# Altium project PCB_Project.PrjPcb
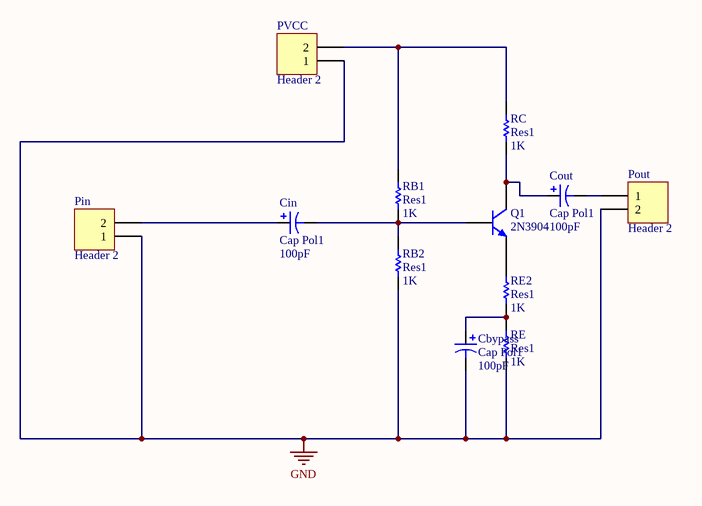
[diagram p0: Sheet1.SchDoc]
1 sheet, 12 parts. Net scope: global (net labels, ports and power ports of the same name join across sheets).
Board file: PCB1.PcbDoc

## Sheet Sheet1.SchDoc
size A

### Parts
Cbypass  Cap Pol1  value 100pF  [RB7.6-15]
Cin  Cap Pol1  value 100pF  [RB7.6-15]
Cout  Cap Pol1  value 100pF  [RB7.6-15]
Pin  Header 2  [HDR1X2]
Pout  Header 2  [HDR1X2]
PVCC  Header 2  [HDR1X2]
Q1  2N3904  [TO-92A]
RB1  Res1  value 1K  [AXIAL-0.3]
RB2  Res1  value 1K  [AXIAL-0.3]
RC  Res1  value 1K  [AXIAL-0.3]
RE  Res1  value 1K  [AXIAL-0.3]
RE2  Res1  value 1K  [AXIAL-0.3]

### Nets
GND: Cbypass.2 Pin.1 Pout.2 PVCC.1 RB2.1 RE.1
NetCbypass_1: Cbypass.1 RE.2 RE2.1
NetCin_1: Cin.1 Pin.2
NetCin_2: Cin.2 Q1.2(B) RB1.1 RB2.2
NetCout_1: Cout.1 Q1.3(C) RC.1
NetCout_2: Cout.2 Pout.1
NetPVCC_2: PVCC.2 RB1.2 RC.2
NetQ1_1: Q1.1(E) RE2.2

### Library data of the parts
Cbypass Cin Cout = Cap Pol1: Polarized Capacitor (Radial); Published: 8-Jun-2000; LatestRevisionDate: 17-Jul-2002; LatestRevisionNote: Re-released for DXP Platform.; PackageReference: RB7.6-15; Publisher: Altium Limited; PackageDescription: Polarized Capacitor (Radial); 2 Leads
Pin Pout PVCC = Header 2: Header, 2-Pin; LatestRevisionDate: 17-Jul-2002; LatestRevisionNote: Re-released for DXP Platform.; Publisher: Altium Limited
Q1 = 2N3904: NPN General Purpose Amplifier; Published: 8-Jun-2000; LatestRevisionDate: 15-Jan-2003; LatestRevisionNote: PCB Footprint 'BCY-W3/D4.7' replaced; DatasheetVersion: 1997; PackageVersion: Sep-1998; PackageReference: TO-92A; Publisher: Altium Limited; PackageDescription: TO, Flat Index; 3 In-Line, Axial Leads; Body Dia. 4.5mm; Leads 0.51 x 0.48 mm (max); ComponentLink1Description: Manufacturer Link; ComponentLink1URL: http://www.fairchildsemi.com/; ComponentLink2Description: Datasheet; ComponentLink2URL: http://www.fairchildsemi.com/ds/2N%2F2N3904.pdf
RB1 RB2 RC RE RE2 = Res1: Resistor; Published: 8-Jun-2000; LatestRevisionDate: 17-Jul-2002; LatestRevisionNote: Re-released for DXP Platform.; PackageReference: AXIAL-0.3; Publisher: Altium Limited; PackageDescription: Axial Device, Thru-Hole; 2 Leads; 0.3 in Pin Spacing